# Altium project AtomlzerPcb.PrjPcb
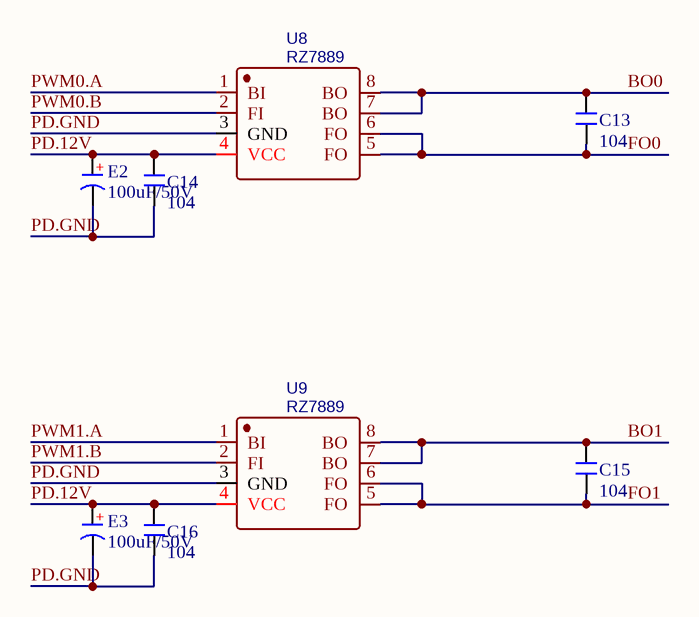
[diagram p0: Motor.SchDoc]
5 sheets, 101 parts. Net scope: global (net labels, ports and power ports of the same name join across sheets).
Board file: AtomlzerPcb.PcbDoc
Sheets:
  Motor.SchDoc
  Core.SchDoc
  Power.SchDoc
  Do.SchDoc
  Interface.SchDoc

## Sheet Motor.SchDoc
size A4

### Parts
C13  104  [C 0603]
C14  104  [C 0603]
C15  104  [C 0603]
C16  104  [C 0603]
E2  100uF/50V  [CM F(10*10.2)]
E3  100uF/50V  [CM F(10*10.2)]
U8  RZ7889  [SOP8_L]
U9  RZ7889  [SOP8_L]

### Nets
BO0: C13.2 U8.7(BO) U8.8(BO)
BO1: C15.2 U9.7(BO) U9.8(BO)
FO0: C13.1 U8.5(FO) U8.6(FO)
FO1: C15.1 U9.5(FO) U9.6(FO)
PD.12V: C14.2 C16.2 E2.1(A) E3.1(A) U8.4(VCC) U9.4(VCC)
PD.GND: C14.1 C16.1 E2.2(K) E3.2(K) U8.3(GND) U9.3(GND)
PWM0.A: U8.1(BI)
PWM0.B: U8.2(FI)
PWM1.A: U9.1(BI)
PWM1.B: U9.2(FI)

### Notes on the sheet
- (in symbol C-CM) +

### Library data of the parts
C13-C16 = C: 无极性贴片电容; 版权归属: 源创客; 材质: X7R; BOM名称: 无极性贴片电容; 学习资源: www.ooocke.com
E2 E3 = C-CM: 贴片电解电容; 版权归属: 源创客; BOM名称: 贴片电解电容; 学习资源: www.ooocke.com
U8 U9 = RZ7889: BOM_Manufacturer: RZ; BOM_Paste Type: recommend; BOM_Supplier: LCSC; BOM_Manufacturer Part: RZ7889; BOM_Supplier Part: C83668; spicePre: U; spiceSymbolName: RZ7889

## Sheet Core.SchDoc
size A4
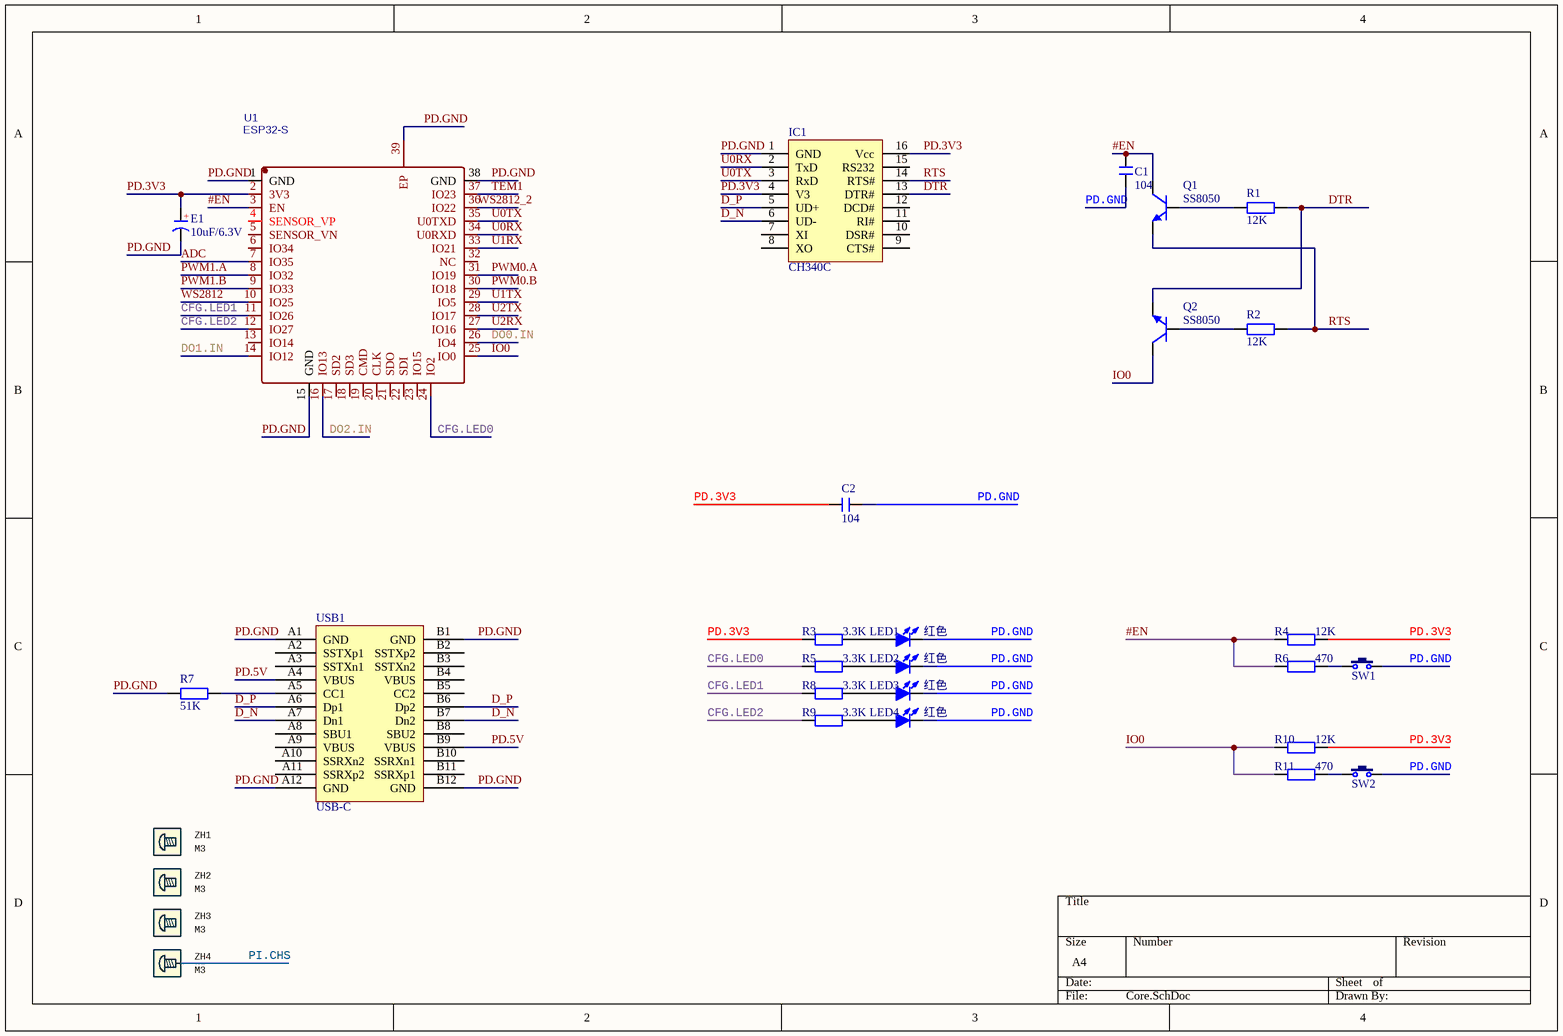
[diagram p1: Core.SchDoc]

### Parts
C1  104  [C 0603_L]
C2  104  [C 0603]
E1  10uF/6.3V  [CD A(3216)]
IC1  CH340C  [SOP16_L]
LED1  红色  [LED 0603R]
LED2  红色  [LED 0603R]
LED3  红色  [LED 0603R]
LED4  红色  [LED 0603R]
Q1  SS8050  [SOT23-3N]
Q2  SS8050  [SOT23-3N]
R1  12K  [R 0603]
R2  12K  [R 0603]
R3  3.3K  [R 0603]
R4  12K  [R 0603]
R5  3.3K  [R 0603]
R6  470  [R 0603]
R7  51K  [R 0603]
R8  3.3K  [R 0603]
R9  3.3K  [R 0603]
R10  12K  [R 0603]
R11  470  [R 0603]
SW1  3x6x5  [TSW SMD-3*6*2.5]  (value not drawn)
SW2  3x6x5  [TSW SMD-3*6*2.5]  (value not drawn)
U1  ESP32-S  [ESP32-S]
USB1  USB-C  [TYPE-C-31-M-12]
ZH1  M3  [ZH_Mount_NPH_M3.0]  (no BOM)
ZH2  M3  [ZH_Mount_NPH_M3.0]  (no BOM)
ZH3  M3  [ZH_Mount_NPH_M3.0]  (no BOM)
ZH4  M3  [ZH_Mount_PH_M3.0]  (no BOM)

### Nets
#EN: C1.2 Q1.3(C) R4.2 R6.2 U1.3(EN)
ADC: U1.7(IO35)
CFG.LED0: R5.2 U1.24(IO2)
CFG.LED1: R8.2 U1.11(IO26)
CFG.LED2: R9.2 U1.12(IO27)
D_N: IC1.6(UD-) USB1.A7(Dn1) USB1.B7(Dn2)
D_P: IC1.5(UD+) USB1.A6(Dp1) USB1.B6(Dp2)
DO0.IN: U1.26(IO4)
DO1.IN: U1.14(IO12)
DO2.IN: U1.16(IO13)
DTR: IC1.13(DTR#) Q2.2(E) R1.2
IO0: Q2.3(C) R10.2 R11.2 U1.25(IO0)
PD.3V3: C2.2 E1.1(A) IC1.4(V3) IC1.16(Vcc) R3.2 R4.1 R10.1 U1.2(3V3)
PD.5V: USB1.A4(VBUS) USB1.B9(VBUS)
PD.GND: C1.1 C2.1 E1.2(K) IC1.1(GND) LED1.2(K) LED2.2(K) LED3.2(K) LED4.2(K) R7.2 SW1.2 SW2.2 U1.1(GND) U1.15(GND) U1.38(GND) U1.39(EP) USB1.A1(GND) USB1.A12(GND) USB1.B1(GND) USB1.B12(GND)
PI.CHS: ZH4.H
PWM0.A: U1.31(IO19)
PWM0.B: U1.30(IO18)
PWM1.A: U1.8(IO32)
PWM1.B: U1.9(IO33)
RTS: IC1.14(RTS#) Q1.2(E) R2.2
TEM1: U1.37(IO23)
U0RX: IC1.2(TxD) U1.34(U0RXD)
U0TX: IC1.3(RxD) U1.35(U0TXD)
U1RX: U1.33(IO21)
U1TX: U1.29(IO5)
U2RX: U1.27(IO16)
U2TX: U1.28(IO17)
WS2812: U1.10(IO25)
WS2812_2: U1.36(IO22)
NetLED1_1: LED1.1(A) R3.1
NetLED2_1: LED2.1(A) R5.1
NetLED3_1: LED3.1(A) R8.1
NetLED4_1: LED4.1(A) R9.1
NetQ1_1: Q1.1(B) R1.1
NetQ2_1: Q2.1(B) R2.1
NetR6_1: R6.1 SW1.1
NetR7_1: R7.1 USB1.A5(CC1)
NetR11_1: R11.1 SW2.1

Not connected (* = marked no-connect by the designer): IC1 7(XI) 8(XO) 9(CTS#) 10(DSR#) 11(RI#) 12(DCD#) 15(RS232); U1 4(SENSOR_VP) 5(SENSOR_VN) 6(IO34) 13(IO14) 17(SD2) 18(SD3) 19(CMD) 20(CLK) 21(SDO) 22(SDI) 23(IO15) 32(NC); USB1 A2(SSTXp1) A3(SSTXn1) A8(SBU1) A9(VBUS) A10(SSRXn2) A11(SSRXp2) B2(SSTXp2) B3(SSTXn2) B4(VBUS) B5(CC2) B8(SBU2) B10(SSRXn1) B11(SSRXp1)

### Notes on the sheet
- (in symbol C-CD) +

### Library data of the parts
C1 = C: 无极性贴片电容; 版权归属: 源创客; 材质: X7R; BOM名称: 无极性贴片电容; 学习资源: www.ooocke.com
C2 = C: 无极性贴片电容; 版权归属: 源创客; BOM名称: 无极性贴片电容; 学习资源: www.ooocke.com
E1 = C-CD: 贴片钽电容; 版权归属: 源创客; BOM名称: 贴片钽电容; 学习资源: www.ooocke.com
IC1 = CH340G: 串口转USB; 版权归属: 源创客; BOM名称: 串口转USB; 学习资源: www.ooocke.com
LED1-LED4 = LED-SMD: 贴片LED; 版权归属: 源创客; BOM名称: 贴片LED; 学习资源: www.ooocke.com
Q1 Q2 = 8050-SMD: 高频放大-NPN型; 版权归属: 源创客; 属性: 40V 1.5A 1W 100MHZ; BOM名称: 高频放大-NPN型; 学习资源: www.ooocke.com
R1-R11 = R: 贴片电阻; 版权归属: 源创客; BOM名称: 贴片电阻; 学习资源: www.ooocke.com
SW1 SW2 = TSW 3x6: 3x6轻触开关; 版权归属: 源创客; BOM名称: 3x6轻触开关; 学习资源: www.ooocke.com
U1 = ESP32-S: BOM_Manufacturer: Ai-Thinker; Contributor: LCSC; BOM_Paste Type: expand; BOM_Supplier: LCSC; BOM_Supplier Part: C277944; BOM_Manufacturer Part: ESP32-S; spicePre: U; spiceSymbolName: ESP32-S
USB1 = USB-C/S: USB-C型母接口; 版权归属: 源创客; BOM名称: USB-C型母接口; 学习资源: www.ooocke.com
ZH1-ZH3 = Misc_Mount: ZH
ZH4 = Misc_Mount_Plated: ZH; ARG-CON-Dir: YES

## Sheet Power.SchDoc
size A4
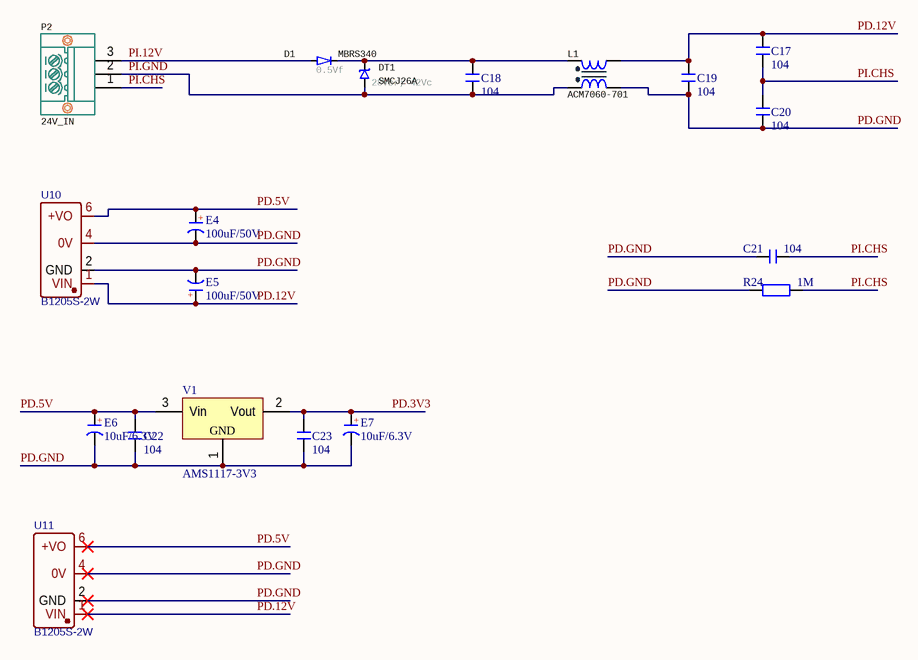
[diagram p2: Power.SchDoc]

### Parts
C17  104  [C 1210]
C18  104  [C 1210]
C19  104  [C 1210]
C20  104  [C 1210]
C21  104  [C 1210]
C22  104  [C 1210]
C23  104  [C 1210]
D1  MBRS340  01_INF: 0.5Vf  [D-SMC]
DT1  SMCJ26A  01_INF: 28Vbr; 42Vc  [D-SMC]
E4  100uF/50V  [CM F(10*10.2)]
E5  100uF/50V  [CM F(10*10.2)]
E6  10uF/6.3V  [CD A(3216)]
E7  10uF/6.3V  [CD A(3216)]
L1  ACM7060-701  [TDK_Choke_ACM7060]
P2  24V_IN  [C00170]
R24  1M  [R 1206_L]
U10  B1205S-2W  [B1205S-2W]
U11  B1205S-2W  [B1205S-2W]
V1  AMS1117-3V3  [SOT223_L]

### Nets
PD.3V3: C23.1 E7.1(A) V1.2(Vout)
PD.5V: C22.1 E4.1(A) E6.1(A) U10.6(+VO) U11.6(+VO) V1.3(Vin)
PD.12V: C17.1 C19.2 E5.1(A) L1.A2 U10.1(VIN) U11.1(VIN)
PD.GND: C19.1 C20.2 C21.1 C22.2 C23.2 E4.2(K) E5.2(K) E6.2(K) E7.2(K) L1.B2 R24.1 U10.2(GND) U10.4(0V) U11.2(GND) U11.4(0V) V1.1(GND)
PI.12V: D1.1 P2.3
PI.CHS: C17.2 C20.1 C21.2 P2.1 R24.2
PI.GND: C18.1 DT1.1 L1.B1 P2.2
NetC18_2: C18.2 D1.2 DT1.2 L1.A1

### Notes on the sheet
- (in symbol C-CD) +
- (in symbol C-CM) +

### Library data of the parts
C17-C23 = C: 无极性贴片电容; 版权归属: 源创客; BOM名称: 无极性贴片电容; 学习资源: www.ooocke.com
D1 = Diode: D-SMC-MBRS340; 02_CMT: OnSemi MBRS340T3G; 10_Code: C40326; 11_Name: 贴装元件_肖特基二极管_MBRS340_SMC
DT1 = Diode_TVS_UniDirectional: DT-SMC-SMCJ26A; 02_CMT: LittleFuse SMCJ26A; TM: GFE; 10_Code: C224046; 11_Name: 贴装元件_单向TVS_SMC_26V
E4 E5 = C-CM: 贴片电解电容; 版权归属: 源创客; BOM名称: 贴片电解电容; 学习资源: www.ooocke.com
E6 E7 = C-CD: 贴片钽电容; 版权归属: 源创客; BOM名称: 贴片钽电容; 学习资源: www.ooocke.com
L1 = IND_CHOKE: L-ACM7060-701; 10_Code: C78246; 11_Name: 贴装电感_共模_ACM7060-701-2PL-TL01
P2 = C00170_绿座_弯_针_单排_3.50_3P_紧固: P-插装绿座_弯_针_单排_3.5_3P_紧固; 11_Name: 插装绿座_弯_针_单排_3.5_3P_紧固
R24 = R: 贴片电阻; 版权归属: 源创客; BOM名称: 贴片电阻; 学习资源: www.ooocke.com
U10 U11 = B1205S-2W: BOM_Manufacturer: JETEKPS; Contributor: LCSC; BOM_Paste Type: expand; BOM_Supplier: LCSC; BOM_Supplier Part: C442553; BOM_Manufacturer Part: B1205S-2W; spicePre: U; spiceSymbolName: B1205S-2W
V1 = AMS1117: 三端稳压芯片; BOM名称: 稳压芯片; 版权归属: 源创客; 学习资源: www.ooocke.com

## Sheet Do.SchDoc
size A4
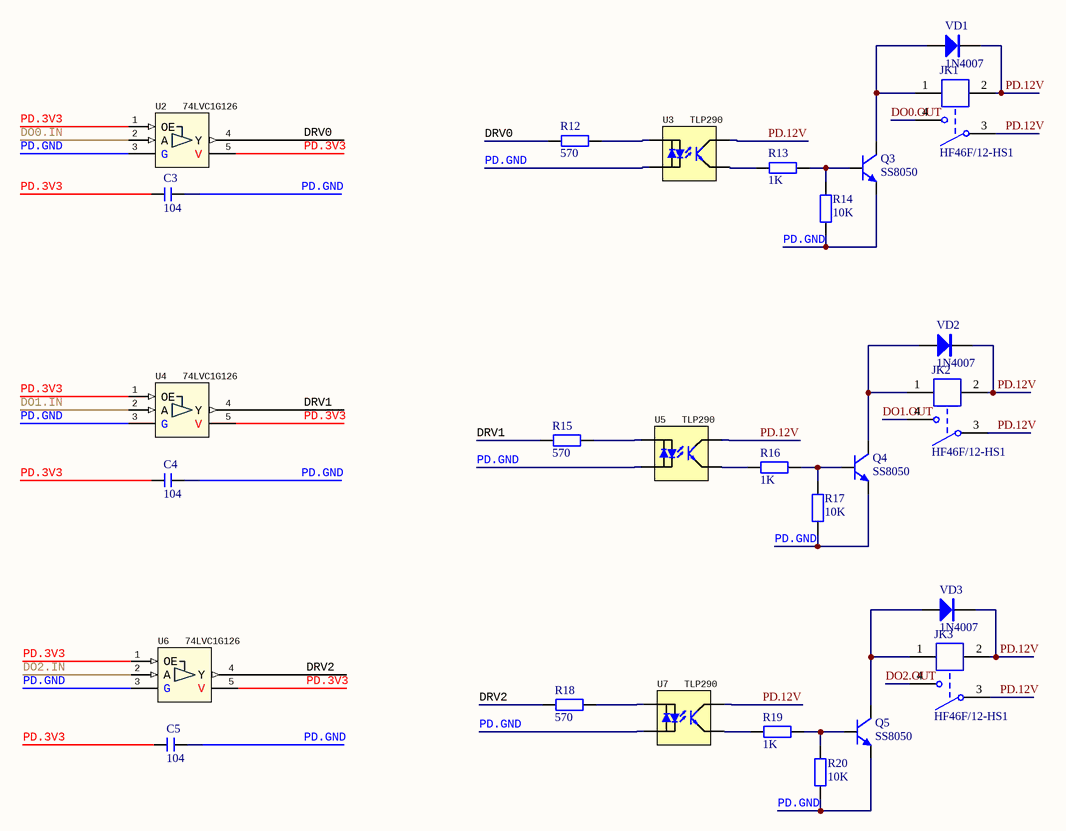
[diagram p3: Do.SchDoc]

### Parts
C3  104  [C 0603]
C4  104  [C 0603]
C5  104  [C 0603]
JK1  HF46F/12-HS1  [HF46F/12-HS1]
JK2  HF46F/12-HS1  [HF46F/12-HS1]
JK3  HF46F/12-HS1  [HF46F/12-HS1]
Q3  SS8050  [SOT23-3N]
Q4  SS8050  [SOT23-3N]
Q5  SS8050  [SOT23-3N]
R12  570  [R 0603]
R13  1K  [R 0603]
R14  10K  [R 0603]
R15  570  [R 0603]
R16  1K  [R 0603]
R17  10K  [R 0603]
R18  570  [R 0603]
R19  1K  [R 0603]
R20  10K  [R 0603]
U2  74LVC1G126  [TSSOP-5P-0.65BSC-2.15x1.40Bmax-1.10Hmax]
U3  TLP290  [SO-4-1.27BSC-4.6W-TLP]
U4  74LVC1G126  [TSSOP-5P-0.65BSC-2.15x1.40Bmax-1.10Hmax]
U5  TLP290  [SO-4-1.27BSC-4.6W-TLP]
U6  74LVC1G126  [TSSOP-5P-0.65BSC-2.15x1.40Bmax-1.10Hmax]
U7  TLP290  [SO-4-1.27BSC-4.6W-TLP]
VD1  1N4007  [SMA]
VD2  1N4007  [SMA]
VD3  1N4007  [SMA]

### Nets
DO0.IN: U2.2(A)
DO0.OUT: JK1.4
DO1.IN: U4.2(A)
DO1.OUT: JK2.4
DO2.IN: U6.2(A)
DO2.OUT: JK3.4
DRV0: R12.1 U2.4(Y)
DRV1: R15.1 U4.4(Y)
DRV2: R18.1 U6.4(Y)
PD.3V3: C3.2 C4.2 C5.2 U2.1(OE) U2.5(V) U4.1(OE) U4.5(V) U6.1(OE) U6.5(V)
PD.12V: JK1.2 JK1.3 JK2.2 JK2.3 JK3.2 JK3.3 U3.4 U5.4 U7.4 VD1.2(K) VD2.2(K) VD3.2(K)
PD.GND: C3.1 C4.1 C5.1 Q3.2(E) Q4.2(E) Q5.2(E) R14.1 R17.1 R20.1 U2.3(G) U3.2 U4.3(G) U5.2 U6.3(G) U7.2
NetJK1_1: JK1.1 Q3.3(C) VD1.1(A)
NetJK2_1: JK2.1 Q4.3(C) VD2.1(A)
NetJK3_1: JK3.1 Q5.3(C) VD3.1(A)
NetQ3_1: Q3.1(B) R13.2 R14.2
NetQ4_1: Q4.1(B) R16.2 R17.2
NetQ5_1: Q5.1(B) R19.2 R20.2
NetR12_2: R12.2 U3.1
NetR13_1: R13.1 U3.3
NetR15_2: R15.2 U5.1
NetR16_1: R16.1 U5.3
NetR18_2: R18.2 U7.1
NetR19_1: R19.1 U7.3

### Library data of the parts
C3-C5 = C: 无极性贴片电容; 版权归属: 源创客; BOM名称: 无极性贴片电容; 学习资源: www.ooocke.com
JK1-JK3 = HF46F/12-HS1: 12V一组常开; BOM名称: 12V继电器; 版权归属: 源创客; 学习资源: www.ooocke.com
Q3-Q5 = 8050-SMD: as Q1 on sheet Core; BOM名称: 高频放大-NPN型; 学习资源: www.ooocke.com
R12-R20 = R: 贴片电阻; 版权归属: 源创客; BOM名称: 贴片电阻; 学习资源: www.ooocke.com
U2 U4 U6 = 74LVC1G126: U-LVC1G126; 02_CMT: NXP GW, TM: VN; TI DCK, TM: CN; 10_Code: C55052; 11_Name: 贴装芯片_Nexperia_74LVC1G126GW
U3 U5 U7 = TLP290: U-TLP290; 10_Code: C424197; 11_Name: 贴装芯片_TLP290
VD1-VD3 = 1N4007: 整流二极管; BOM名称: 1N4148WS; 版权归属: 源创客; 学习资源: www.ooocke.com

## Sheet Interface.SchDoc
size A4
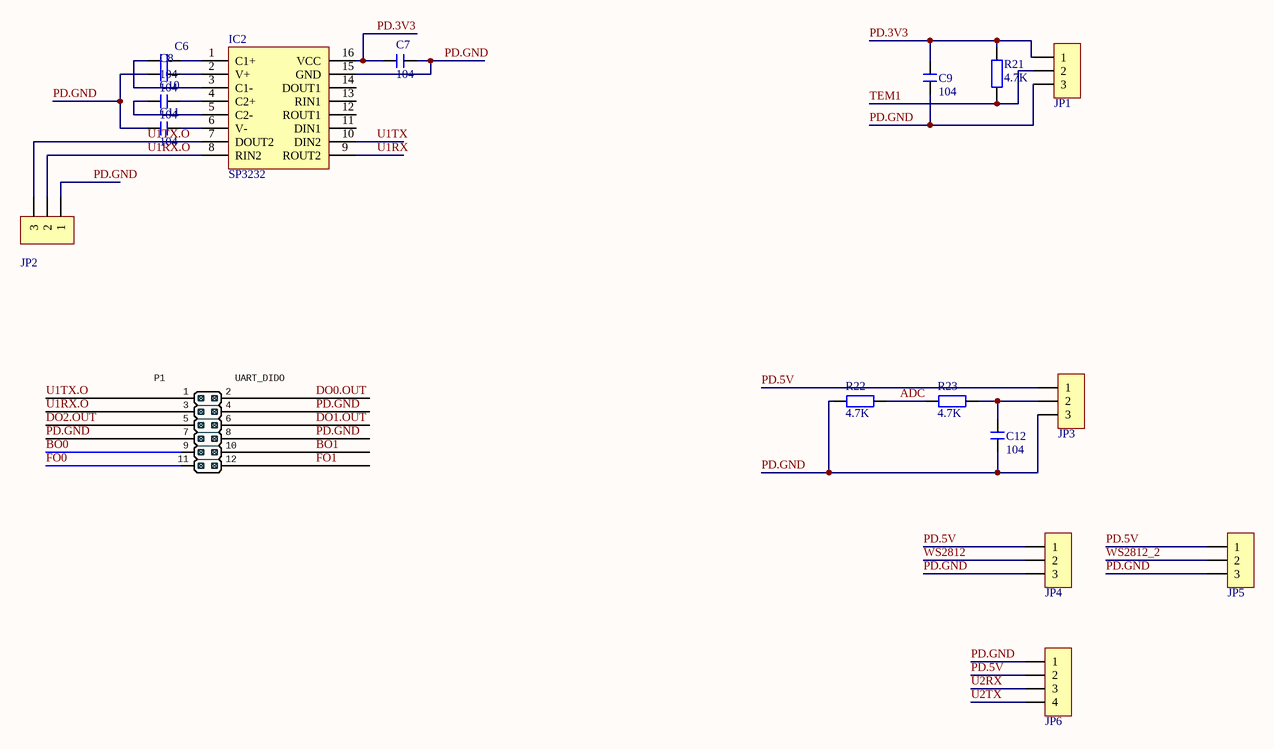
[diagram p4: Interface.SchDoc]

### Parts
C6  104  [C 0603]
C7  104  [C 0603]
C8  104  [C 0603]
C9  104  [C 0603]
C10  104  [C 0603]
C11  104  [C 0603]
C12  104  [C 0603]
IC2  SP3232  [TSSOP16_N]
JP1  HDR-1X3  [WJ15EDGRC-3.81-3P]  (value not drawn)
JP2  HDR-1X3  [XH2.54-3P]  (value not drawn)
JP3  HDR-1X3  [WJ15EDGRC-3.81-3P]  (value not drawn)
JP4  HDR-1X3  [WJ15EDGRC-3.81-3P]  (value not drawn)
JP5  HDR-1X3  [WJ15EDGRC-3.81-3P]  (value not drawn)
JP6  HDR-1X4  [XH2.54-4P]  (value not drawn)
P1  UART_DIDO  [KF2EDGRHM-3.81-2x6P]
R21  4.7K  [R 0603]
R22  4.7K  [R 0603]
R23  4.7K  [R 0603]

### Nets
ADC: R22.1 R23.2
BO0: P1.9
BO1: P1.10
DO0.OUT: P1.2
DO1.OUT: P1.6
DO2.OUT: P1.5
FO0: P1.11
FO1: P1.12
PD.3V3: C7.1 C9.2 IC2.16(VCC) JP1.1 R21.2
PD.5V: JP3.1 JP4.1 JP5.1 JP6.2
PD.GND: C7.2 C8.1 C9.1 C11.1 C12.1 IC2.15(GND) JP1.3 JP2.1 JP3.3 JP4.3 JP5.3 JP6.1 P1.4 P1.7 P1.8 R22.2
TEM1: JP1.2 R21.1
U1RX: IC2.9(ROUT2)
U1RX.O: IC2.8(RIN2) JP2.2 P1.3
U1TX: IC2.10(DIN2)
U1TX.O: IC2.7(DOUT2) JP2.3 P1.1
U2RX: JP6.3
U2TX: JP6.4
WS2812: JP4.2
WS2812_2: JP5.2
NetC6_1: C6.1 IC2.3(C1-)
NetC6_2: C6.2 IC2.1(C1+)
NetC8_2: C8.2 IC2.2(V+)
NetC10_1: C10.1 IC2.5(C2-)
NetC10_2: C10.2 IC2.4(C2+)
NetC11_2: C11.2 IC2.6(V-)
NetC12_2: C12.2 JP3.2 R23.1

Not connected (* = marked no-connect by the designer): IC2 11(DIN1) 12(ROUT1) 13(RIN1) 14(DOUT1)

### Library data of the parts
C6-C12 = C: 无极性贴片电容; 版权归属: 源创客; BOM名称: 无极性贴片电容; 学习资源: www.ooocke.com
IC2 = SP3232: RS232通讯芯片; 版权归属: 源创客; BOM名称: RS232通讯芯片; 学习资源: www.ooocke.com
JP1-JP5 = Header 3: 3P接插件; 版权归属: 源创客; BOM名称: 3P接插件; 学习资源: www.ooocke.com
JP6 = Header 4: 4P接插件; 版权归属: 源创客; BOM名称: 4P接插件; 学习资源: www.ooocke.com
P1 = PIN_2xCol_6xPin: P-EDG-2x6; 11_Name: 插装元件_KF2EDGRHM-3.5-12P
R21-R23 = R: 贴片电阻; 版权归属: 源创客; BOM名称: 贴片电阻; 学习资源: www.ooocke.com

## Nets that join several sheets
ADC: Core (U1.7), Interface (R22.1 R23.2)
BO0: Motor (C13.2 U8.7 U8.8), Interface (P1.9)
BO1: Motor (C15.2 U9.7 U9.8), Interface (P1.10)
DO0.IN: Core (U1.26), Do (U2.2)
DO0.OUT: Do (JK1.4), Interface (P1.2)
DO1.IN: Core (U1.14), Do (U4.2)
DO1.OUT: Do (JK2.4), Interface (P1.6)
DO2.IN: Core (U1.16), Do (U6.2)
DO2.OUT: Do (JK3.4), Interface (P1.5)
FO0: Motor (C13.1 U8.5 U8.6), Interface (P1.11)
FO1: Motor (C15.1 U9.5 U9.6), Interface (P1.12)
PD.3V3: Core (8 pins), Power (C23.1 E7.1 V1.2), Do (9 pins), Interface (5 pins)
PD.5V: Core (USB1.A4 USB1.B9), Power (6 pins), Interface (JP3.1 JP4.1 JP5.1 JP6.2)
PD.12V: Motor (6 pins), Power (6 pins), Do (12 pins)
PD.GND: Motor (6 pins), Core (19 pins), Power (16 pins), Do (15 pins), Interface (16 pins)
PI.CHS: Core (ZH4.H), Power (5 pins)
PWM0.A: Motor (U8.1), Core (U1.31)
PWM0.B: Motor (U8.2), Core (U1.30)
PWM1.A: Motor (U9.1), Core (U1.8)
PWM1.B: Motor (U9.2), Core (U1.9)
TEM1: Core (U1.37), Interface (JP1.2 R21.1)
U1RX: Core (U1.33), Interface (IC2.9)
U1TX: Core (U1.29), Interface (IC2.10)
U2RX: Core (U1.27), Interface (JP6.3)
U2TX: Core (U1.28), Interface (JP6.4)
WS2812: Core (U1.10), Interface (JP4.2)
WS2812_2: Core (U1.36), Interface (JP5.2)